# EAGLE schematic protoLoad (EAGLE 6.4)
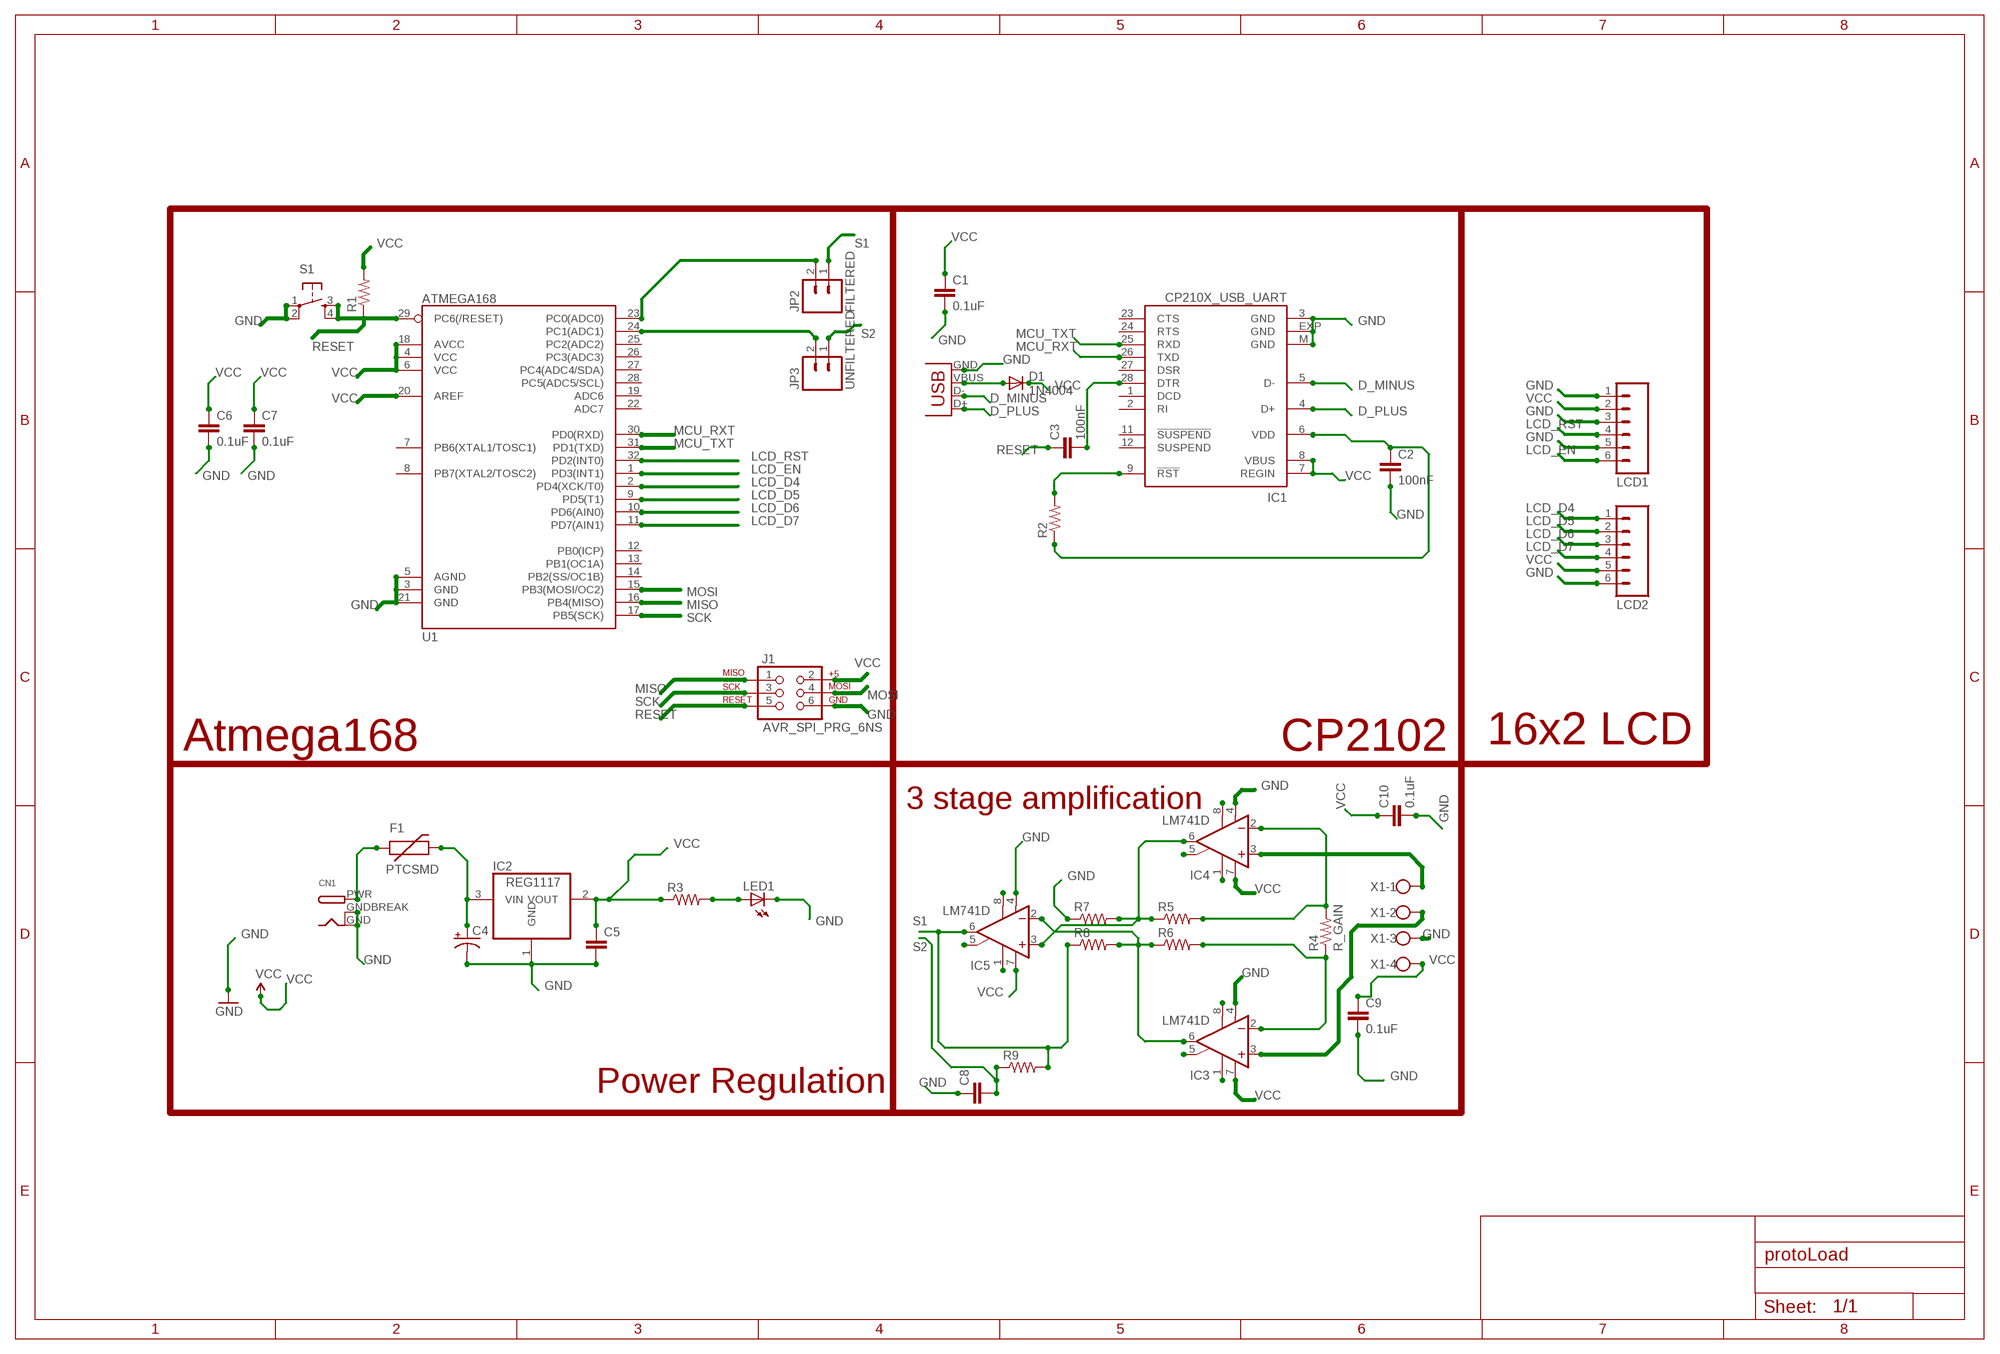
[diagram p0: schematic, sheet 1]

## Parts
C1  0.1uF  CAP0805  [0805]
C2  100nF  CAP0805  [0805]
C3  100nF  CAP0805  [0805]
C4  CAP_POL7343  [EIA7343]
C5  CAP0805  [0805]
C6  0.1uF  CAP0805  [0805]
C7  0.1uF  CAP0805  [0805]
C8  CAP0805  [0805]
C9  0.1uF  CAP0805  [0805]
C10  0.1uF  CAP0805  [0805]
CN1  DCBARRELPTH  [DCJACK_2MM_PTH]
D1  1N4004  DIODESMA-ALT  [SMA-DIODE_ALT]
F1  PTCSMD  [PTC-1206]
IC1  CP210X_USB_UART  [MLP28]
IC2  REG1117  [SOT223]
IC3  LM741D  [SO08]
IC4  LM741D  [SO08]
IC5  LM741D  [SO08]
J1  AVR_SPI_PRG_6NS  [2X3-NS]
JP1  USBSMD  [USB-MINIB]
JP2  FILTERED  M02PTH3  [1X02_LONGPADS]
JP3  UNFILTERED  M02PTH3  [1X02_LONGPADS]
LCD1  M06LONGPADS  [1X06_LONGPADS]
LCD2  M06LONGPADS  [1X06_LONGPADS]
LED1  LEDCHIPLED_1206  [CHIPLED_1206]
R1  RESISTOR0805-RES  [0805]
R2  RESISTOR0805-RES  [0805]
R3  RESISTOR0805-RES  [0805]
R4  R_GAIN  RESISTOR0805-RES  [0805]
R5  RESISTOR0805-RES  [0805]
R6  RESISTOR0805-RES  [0805]
R7  RESISTOR0805-RES  [0805]
R8  RESISTOR0805-RES  [0805]
R9  RESISTOR0805-RES  [0805]
S1  TAC_SWITCHSMD  [TACTILE_SWITCH_SMD]
U1  ATMEGA168  [TQFP32-08]
X1  W237-4  [W237-4]

## Nets
D_MINUS: IC1.5(D-) JP1.D-
D_PLUS: IC1.4(D+) JP1.D+
GND: C1.2 C2.2 C4.C(-) C5.2 C6.2 C7.2 C8.1 C9.2 C10.2 CN1.GND CN1.GNDBREAK IC1.3(GND) IC1.EXP(GND) IC1.M(GND) IC2.1(GND) IC3.4(V-) IC4.4(V-) IC5.4(V-) J1.6 JP1.GND LCD1.1 LCD1.3 LCD1.5 LCD2.6 LED1.C R7.1 S1.1 S1.2 U1.3(GND) U1.5(AGND) U1.21(GND) X1.3
LCD_D4: LCD2.1 U1.2(PD4(XCK/T0))
LCD_D5: LCD2.2 U1.9(PD5(T1))
LCD_D6: LCD2.3 U1.10(PD6(AIN0))
LCD_D7: LCD2.4 U1.11(PD7(AIN1))
LCD_EN: LCD1.6 U1.1(PD3(INT1))
LCD_RST: LCD1.4 U1.32(PD2(INT0))
MCU_RXT: IC1.26(TXD) U1.30(PD0(RXD))
MCU_TXT: IC1.25(RXD) U1.31(PD1(TXD))
MISO: J1.1 U1.16(PB4(MISO))
MOSI: J1.4 U1.15(PB3(MOSI/OC2))
N$1: C3.2 IC1.28(DTR)
N$2: IC1.9(!RST) R2.2
N$3: D1.A JP1.VBUS
N$4: C2.1 IC1.6(VDD) R2.1
N$5: CN1.PWR F1.1
N$6: JP3.2 U1.24(PC1(ADC1))
N$7: LED1.A R3.2
N$10: IC4.3(+IN) X1.1
N$12: IC3.3(+IN) X1.2
N$13: JP2.2 U1.23(PC0(ADC0))
N$14: C4.A(+) F1.2 IC2.3(VIN)
N$18: IC5.1(ON1)
N$20: IC5.8(OPT)
N$23: IC5.5(ON2)
N$24: IC3.6(OUT) IC5.2(-IN) R6.1 R8.2
N$25: IC3.5(ON2)
N$26: IC3.1(ON1)
N$27: IC4.2(-IN) R4.2 R5.2
N$28: IC3.8(OPT)
N$29: IC3.2(-IN) R4.1 R6.2
N$30: IC4.1(ON1)
N$32: IC4.5(ON2)
N$33: IC4.6(OUT) IC5.3(+IN) R5.1 R7.2
N$34: IC4.8(OPT)
RESET: C3.1 J1.5 R1.1 S1.3 S1.4 U1.29(PC6(/RESET))
S1: IC5.6(OUT) JP2.1 R8.1 R9.2
S2: C8.2 JP3.1 R9.1
SCK: J1.3 U1.17(PB5(SCK))
VCC: C1.1 C5.1 C6.1 C7.1 C9.1 C10.1 D1.C IC1.7(REGIN) IC1.8(VBUS) IC2.2(VOUT) IC3.7(V+) IC4.7(V+) IC5.7(V+) J1.2 LCD1.2 LCD2.5 R1.2 R3.1 U1.4(VCC) U1.6(VCC) U1.18(AVCC) U1.20(AREF) X1.4
Unconnected: IC1.1(DCD) IC1.2(RI) IC1.11(!SUSPEND) IC1.12(SUSPEND) IC1.23(CTS) IC1.24(RTS) IC1.27(DSR) U1.7(PB6(XTAL1/TOSC1)) U1.8(PB7(XTAL2/TOSC2)) U1.12(PB0(ICP)) U1.13(PB1(OC1A)) U1.14(PB2(SS/OC1B)) U1.19(ADC6) U1.22(ADC7) U1.25(PC2(ADC2)) U1.26(PC3(ADC3)) U1.27(PC4(ADC4/SDA)) U1.28(PC5(ADC5/SCL))

## Notes on the sheet
- Atmega168 | CP2102 | 16x2 LCD
- 3 stage amplification
- Power Regulation

## Library data of the parts
C1-C3 C5-C10 = SparkFun-Capacitors:CAP: Capacitor Standard 0603 ceramic capacitor, and 0.1" leaded capacitor.
C4 = SparkFun-Capacitors:CAP_POL: Capacitor Polarized These are standard SMD and PTH capacitors. Normally 10uF, 47uF, and 100uF in electrolytic and tantalum varieties. Always verify the external diameter of the through hole cap, it varies with capacity, voltage, and manufacturer. The EIA devices should be standard.
CN1 = adafruit:DCBARREL: 2.0mm DC Barrel Jack DCJACK_2MM_PTH - Through Hole Jack (4UConnector: 05537)
D1 = SparkFun-DiscreteSemi:DIODE: Diode These are standard reverse protection diodes and small signal diodes. SMA package can handle up to about 1A. SOD-323 can handle about 200mA. What the SOD-323 package when ordering, there are some mfgs out there that are 5-pin packages.
F1 = SparkFun-PowerIC:PTC: Resettable Fuse PTC Resettable Fuse. Spark Fun Electronics SKU : COM-08357; PROD_ID: RES-11150
IC1 = SparkFun-DigitalIC:CP210X_USB_UART: Single-Chip USB to UART Bridge Source: www.silabs.com .. CP2101.pdf / cp2102.pdf. Spark Fun Electronics SKU : COM-00310
IC2 = burr-brown:REG1117: 800mA and 1A Low Dropout (LDO) Positive Regulator 1.8V, 2.5V, 2.85V, 3.3V, 5V, and Adj; MPN: REG1117; OC_FARNELL: 1097566; OC_NEWARK: 14P6981
IC3-IC5 = linear:*741: OP AMP
J1 = SparkFun-Connectors:AVR_SPI_PRG_6: AVR ISP 6 Pin This is the reduced ISP connector for AVR programming. Common on Arduino. This footprint will take up less PCB space and can be used with a 10-pin to 6-pin adapter such as SKU: BOB-08508
JP1 = SparkFun-Connectors:USB: USB Connectors USB-B-PTH is fully proven SKU : PRT-00139/CONN-08278 USB-miniB is fully proven SKU : PRT-00587 USB-A-PCB is untested. USB-A-H is throughly reviewed, but untested. Spark Fun Electronics SKU : PRT-00437 USB-B-SMT is throughly reviewed, but untested. Needs silkscreen touching up. USB-A-S has not been used/tested USB-MB-H has not been used/tested USB-MICROB has been used. CONN-09505; PROD_ID: CONN-08193
JP2 JP3 = SparkFun-Connectors:M02: Standard 2-pin 0.1" header. Use with - straight break away headers ( PRT-00116) - right angle break away headers (PRT-00553) - swiss pins (PRT-00743) - machine pins (PRT-00117) - female headers (PRT-00115) Molex polarized connector foot print use with: PRT-08233 with associated crimp pins and housings. 2.54_SCREWTERM for use with PRT-10571. 3.5mm Screw Terminal footprints for PRT-08084 5mm Screw Terminal footprints for use with PRT-08433
LCD1 LCD2 = SparkFun-Connectors:M06: Header 6 Standard 6-pin 0.1" header. Use with straight break away headers (SKU : PRT-00116), right angle break away headers (PRT-00553), swiss pins (PRT-00743), machine pins (PRT-00117), and female headers (PRT-00115). Molex polarized connector foot print use with SKU : PRT-08094 with associated crimp pins and housings. NOTES ON THE VARIANTS LOCK and LOCK_LONGPADS... This footprint was designed to help hold the alignment of a through-hole component (i.e. 6-pin header) while soldering it into place. You may notice that each hole has been shifted either up or down by 0.005 of an inch from it's more standard position (which is a perfectly straight line). This slight alteration caused the pins (the squares in the middle) to touch the edges of the holes. Because they are alternating, it causes a "brace" to hold the component in place. 0.005 has proven to be the perfect amount of "off-center" position when using our standard breakaway headers. Although looks a little odd when you look at the bare footprint, once you have a header in there, the alteration is very hard to notice. Also,if you push a header all the way into place, it is covered up entirely on the bottom side. This idea of altering the position of holes to aid alignment will be further integrated into the Sparkfun Library for other footprints. It can help hold any component with 3 or more connection pins.
LED1 = adafruit:LED: LED OSRAM: - CHIPLED LG R971, LG N971, LY N971, LG Q971, LY Q971, LO R971, LY R971 LH N974, LH R974 LS Q976, LO Q976, LY Q976 LO Q996 - Hyper CHIPLED LW Q18S LB Q993, LB Q99A, LB R99A - SideLED LS A670, LO A670, LY A670, LG A670, LP A670 LB A673, LV A673, LT A673, LW A673 LH A674 LY A675 LS A676, LA A676, LO A676, LY A676, LW A676 LS A679, LY A679, LG A679 - Hyper Micro SIDELED® LS Y876, LA Y876, LO Y876, LY Y876 LT Y87S - SmartLED LW L88C, LW L88S LB L89C, LB L89S, LG L890 LS L89K, LO L89K, LY L89K LS L896, LA L896, LO L896, LY L896 - TOPLED LS T670, LO T670, LY T670, LG T670, LP T670 LSG T670, LSP T670, LSY T670, LOP T670, LYG T670 LG T671, LOG T671, LSG T671 LB T673, LV T673, LT T673, LW T673 LH T674 LS T676, LA T676, LO T676, LY T676, LB T676, LH T676, LSB T676, LW T676 LB T67C, LV T67C, LT T67C, LS T67K, LO T67K, LY T67K, LW E67C LS E67B, LA E67B, LO E67B, LY E67B, LB E67C, LV E67C, LT E67C LW T67C LS T679, LY T679, LG T679 LS T770, LO T770, LY T770, LG T770, LP T770 LB T773, LV T773, LT T773, LW T773 LH T774 LS E675, LA E675, LY E675, LS T675 LS T776, LA T776, LO T776, LY T776, LB T776 LHGB T686 LT T68C, LB T68C - Hyper Mini TOPLED® LB M676 - Mini TOPLED Santana® LG M470 LS M47K, LO M47K, LY M47K Source: http://www.osram.convergy.de/
R1 R3-R9 = SparkFun-Resistors:RESISTOR: Resistor Basic schematic elements and footprints for 0603, 1206, and PTH resistors.
R2 = SparkFun-Passives:RESISTOR: Resistor Basic schematic elements and footprints for 0603, 1206, and PTH resistors.
S1 = SparkFun-Electromechanical:TAC_SWITCH: Momentary Switch Button commonly used for reset or general input. Spark Fun Electronics SKU : COM-00097 SMT- SWCH-08247; PROD_ID: SWCH-08247
U1 = SparkFun-DigitalIC:ATMEGA168: Atmel 32-pin 8-bit micro, 16k flash.
X1 = con-wago-500:W237-4: WAGO SCREW CLAMP; OC_FARNELL: unknown; OC_NEWARK: unknown

## Net classes
1 GND: width 0.61 mm
2 VCC: width 0.406 mm